# EAGLE schematic sensor (EAGLE 6.6.0)
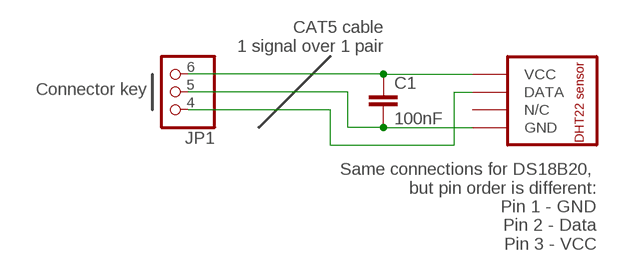
[diagram p0: schematic, sheet 1]

## Parts
C1  100nF  C-EU025-024X044  [C025-024X044]
JP1  PINHD-1X3MOLEX  [1X3/MOLEX]
U$1  DHT22  [DHT22]

## Nets
N$1: C1.1 JP1.6 U$1.P$1(VCC)
N$2: JP1.4 U$1.P$2(DATA)
N$3: C1.2 JP1.5 U$1.P$4(GND)
Unconnected: U$1.P$3(N/C)

## Notes on the sheet
- CAT5 cable
  1 signal over 1 pair
- Connector key
- Same connections for DS18B20, 
  but pin order is different:
  Pin 1 - GND
  Pin 2 - Data
  Pin 3 - VCC

## Library data of the parts
C1 = resistor:C-EU: CAPACITOR, European symbol
JP1 = pinhead:PINHD-1X3: PIN HEADER
U$1 = temp_control:DHT22